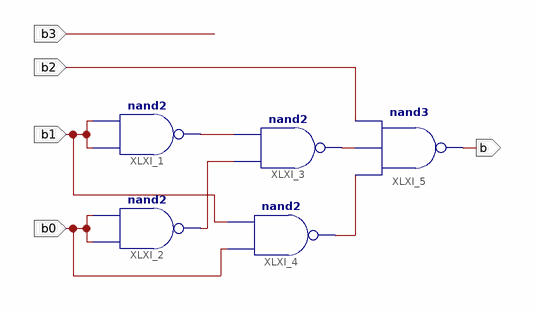
[diagram p0: schematic sheet 1]
// Xilinx ISE schematic b_block.sch (xc9500xl) as structural Verilog: 5 symbols, 5 ports
module b_block (
  input  b2,
  input  b3,
  input  b0,
  input  b1,
  output b
);

  wire XLXN_18, XLXN_19, XLXN_38, XLXN_39;

  nand XLXI_1 (XLXN_18, b1, b1);
  nand XLXI_2 (XLXN_19, b0, b0);
  nand XLXI_3 (XLXN_38, XLXN_19, XLXN_18);
  nand XLXI_4 (XLXN_39, b0, b1);
  nand XLXI_5 (b, XLXN_39, XLXN_38, b2);
endmodule
